# EAGLE schematic ArduRCT_Local-v3 (EAGLE 5.07)
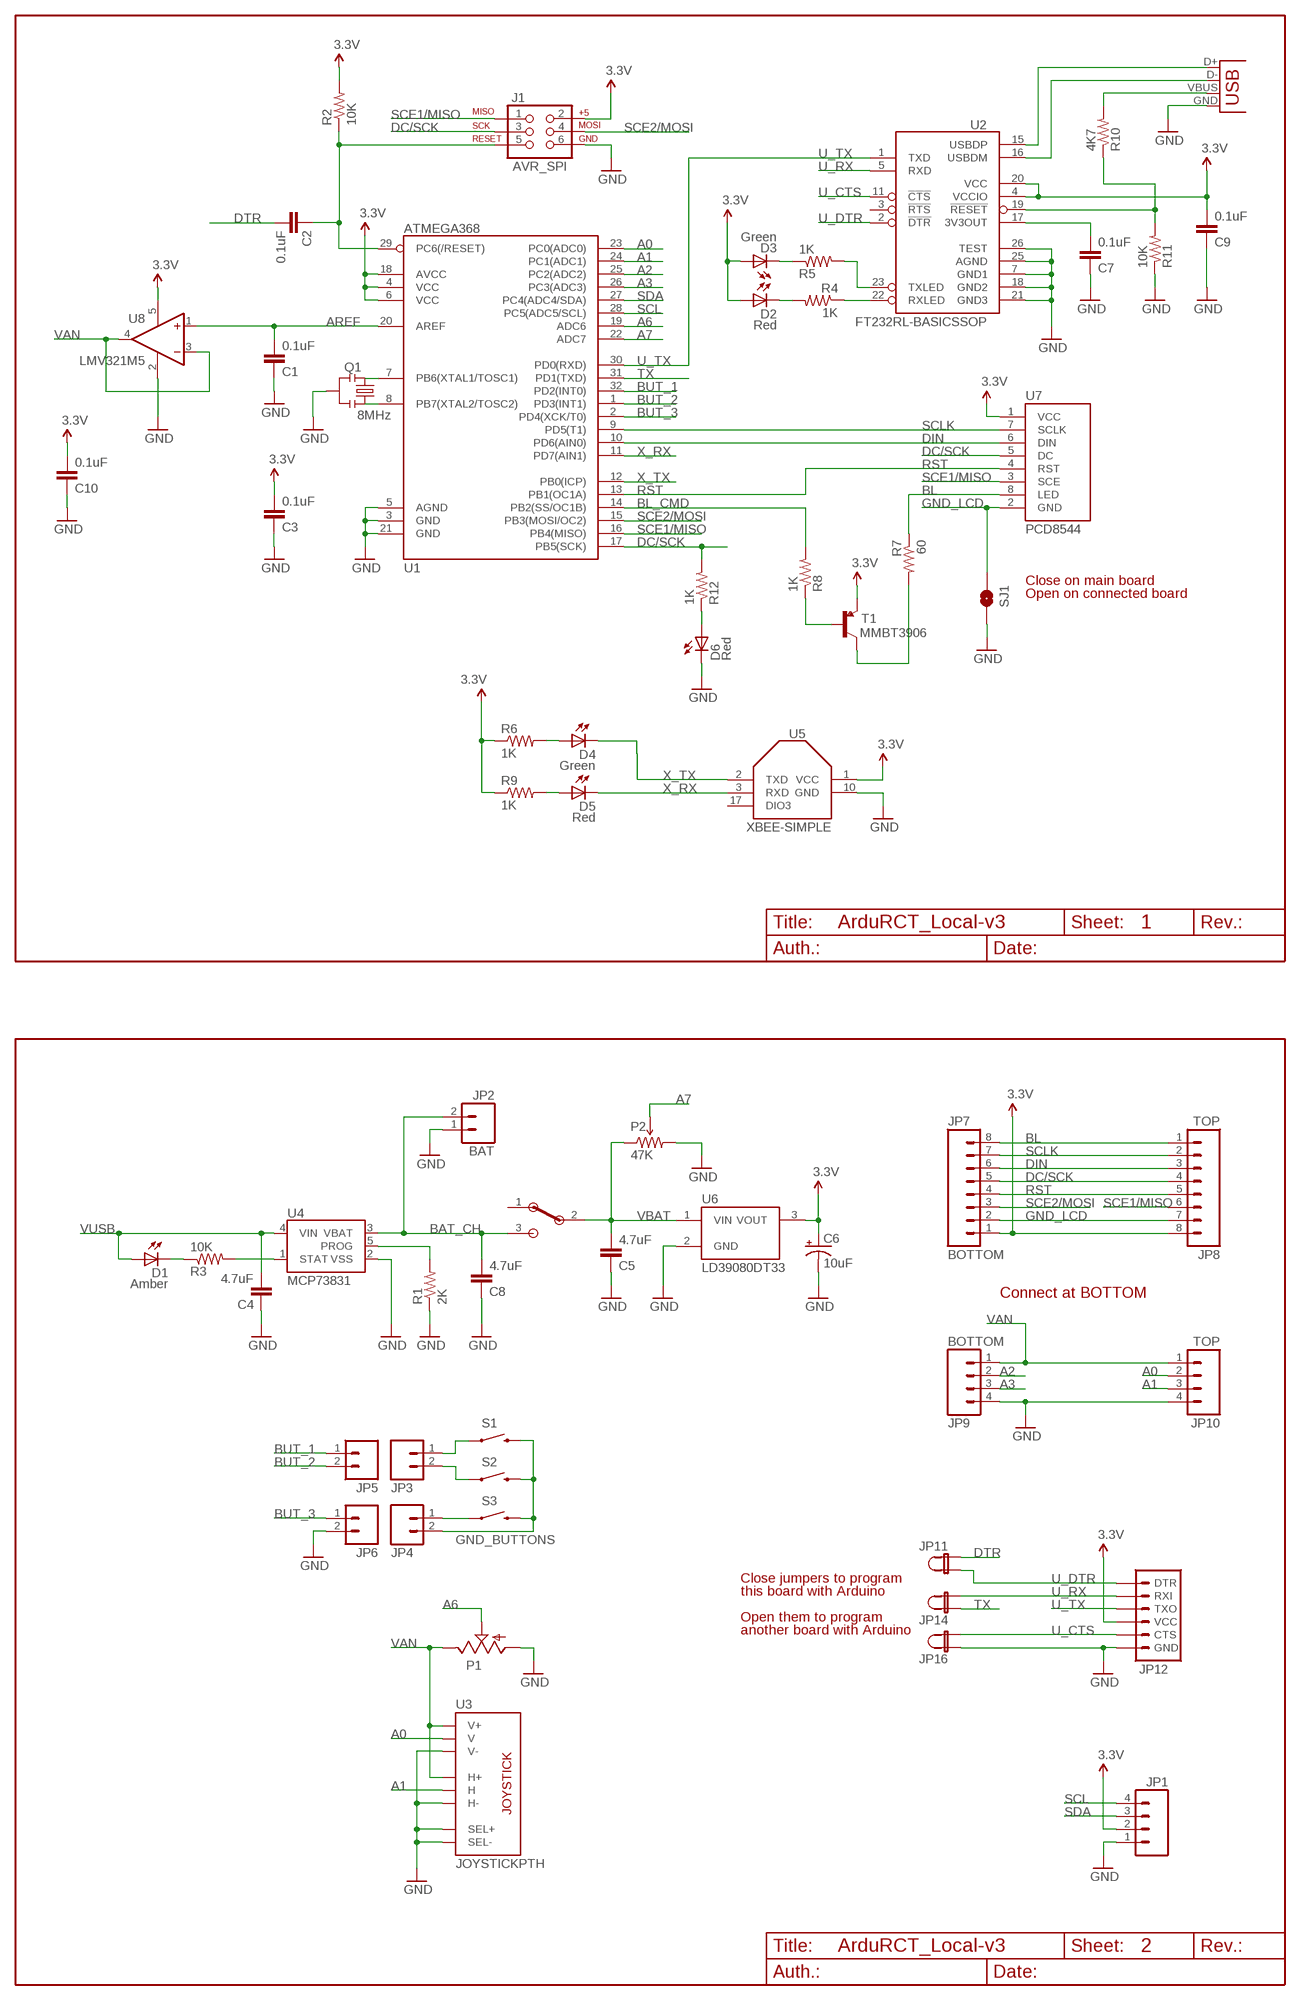
[diagram p0: schematic, sheet 1]

## Parts
C1  0.1uF  CAP0805  [0805]
C2  0.1uF  CAP0805  [0805]
C3  0.1uF  CAP0805  [0805]
C4  4.7uF  CAP0805  [0805]
C5  4.7uF  CAP0805  [0805]
C6  10uF  CAP_POL1206  [EIA3216]
C7  0.1uF  CAP0805  [0805]
C8  4.7uF  CAP0805  [0805]
C9  0.1uF  CAP0805  [0805]
C10  0.1uF  CAP0805  [0805]
D1  Amber  LED  [LED]
D2  Red  LED  [LED]
D3  Green  LED  [LED]
D4  Green  LED  [LED]
D5  Red  LED  [LED]
D6  Red  LED805  [LED-0805]
J1  AVR_SPI  AVR_SPI_PRG_6NS  [2X3-NS]
JP1  M04PTH  [1X04]
JP2  BAT  M02-JST-2MM-SMT  [JST-2-SMD]
JP3  M02PTH  [1X02]
JP4  M02PTH  [1X02]
JP5  M02PTH  [1X02]
JP6  M02PTH  [1X02]
JP7  BOTTOM  M08  [1X8_SMD]
JP8  TOP  M08  [1X8_SMD]
JP9  BOTTOM  M04SMD  [1X4_SMD]
JP10  TOP  M04SMD  [1X4_SMD]
JP11  JP_2_CLOSED  [1X2_CLOSED]
JP12  ARDUINO_SERIAL_PROGRAMPTH  [1X06]
JP14  JP_2_CLOSED  [1X2_CLOSED]
JP16  JP_2_CLOSED  [1X2_CLOSED]
P1  POT  [ALPS_POT]
P2  47K  TRIMPOT-2  [TRIMPOT_TC33]
Q1  8MHz  RESONATORSMD  [RESONATOR-SMD]
R1  2K  RESISTOR0805-RES  [0805]
R2  10K  RESISTOR0805-RES  [0805]
R3  10K  RESISTOR0805-RES  [0805]
R4  1K  RESISTOR0805-RES  [0805]
R5  1K  RESISTOR0805-RES  [0805]
R6  1K  RESISTOR0805-RES  [0805]
R7  60  RESISTOR0805-RES  [0805]
R8  1K  RESISTOR0805-RES  [0805]
R9  1K  RESISTOR0805-RES  [0805]
R10  4K7  RESISTOR0805-RES  [0805]
R11  10K  RESISTOR0805-RES  [0805]
R12  1K  RESISTOR0805-RES  [0805]
S1  SWITCH-MOMENTARY-2PTH  [TACTILE-PTH]
S2  SWITCH-MOMENTARY-2PTH  [TACTILE-PTH]
S3  SWITCH-MOMENTARY-2PTH  [TACTILE-PTH]
S4  EG1224  [EG1224]
SJ1  SOLDERJUMPERNC  [SJ_2S]
T1  MMBT3906  TRANSISTOR_PNPSMD  [SOT23-3]
U1  ATMEGA368  ATMEGA168  [TQFP32-08]
U2  FT232RL-BASICSSOP  [SSOP28DB]
U3  JOYSTICKPTH  [JOYSTICK]
U4  MCP73831  [SOT23-5]
U5  XBEE-SIMPLE  [XBEE-SMD]
U6  LD39080DT33  [DPAK]
U7  PCD8544  [PCD8544]
U8  LMV321M5  [SOT23-5]
X1  USBSMD  [USB-MINIB]

## Nets
3.3V: C3.2 C6.A(+) C9.2 C10.2 D2.A1(A) D3.A1(A) J1.2 JP1.2 JP7.1 JP8.8 JP12.4(VCC) R2.2 R6.1 R9.1 T1.2(E) U1.4(VCC) U1.6(VCC) U1.18(AVCC) U2.4(VCCIO) U2.20(VCC) U5.1(VCC) U6.3(VOUT) U7.1(VCC) U8.5(V+)
A0: JP10.2 U1.23(PC0(ADC0)) U3.V2(V)
A1: JP10.3 U1.24(PC1(ADC1)) U3.H2(H)
A2: JP9.2 U1.25(PC2(ADC2))
A3: JP9.3 U1.26(PC3(ADC3))
A6: P1.P$2(S) U1.19(ADC6)
A7: P2.2(WIPER) U1.22(ADC7)
AREF: C1.2 U1.20(AREF) U8.1(+IN)
BAT_CH: C8.2 JP2.2 S4.3 U4.3(VBAT)
BL: JP7.8 JP8.1 R7.1 U7.8(LED)
BL_CMD: R8.2 U1.14(PB2(SS/OC1B))
BUT_1: JP5.1 U1.32(PD2(INT0))
BUT_2: JP5.2 U1.1(PD3(INT1))
BUT_3: JP6.1 U1.2(PD4(XCK/T0))
DC/SCK: J1.3 JP7.5 JP8.4 R12.2 U1.17(PB5(SCK)) U7.5(DC)
DIN: JP7.6 JP8.3 U1.10(PD6(AIN0)) U7.6(DIN)
DTR: C2.2 JP11.1
GND [vcc]: C1.1 C3.1 C4.1 C5.1 C6.C(-) C7.1 C8.1 C9.1 C10.1 D6.2(C) J1.6 JP1.1 JP2.1 JP6.2 JP9.4 JP10.4 JP12.6(GND) JP16.1 P1.P$3(A) P2.3(CW) Q1.2 R1.1 R11.1 SJ1.2 U1.3(GND) U1.5(AGND) U1.21(GND) U2.7(GND1) U2.18(GND2) U2.21(GND3) U2.25(AGND) U2.26(TEST) U3.B1A(SEL+) U3.B2A(SEL-) U3.H3(H-) U3.V3(V-) U4.2(VSS) U5.10(GND) U6.2(GND) U8.2(V-) X1.GND
GND_BUTTONS: JP4.2 S1.3 S2.3 S3.3
GND_LCD [vcc]: JP7.2 JP8.7 SJ1.1 U7.2(GND)
N$1: Q1.1 U1.8(PB7(XTAL2/TOSC2))
N$2: Q1.3 U1.7(PB6(XTAL1/TOSC1))
N$3: JP3.1 S1.1
N$4: JP3.2 S2.1
N$5: JP4.1 S3.1
N$7: D6.1(A) R12.1
N$8: D1.C1(C) R3.1
N$9: U2.15(USBDP) X1.D+
N$10: U2.16(USBDM) X1.D-
N$11: R10.1 R11.2 U2.19(!RESET)
N$12: R3.2 U4.1(STAT)
N$13: R1.2 U4.5(PROG)
N$14: D5.A1(A) R9.2
N$17: R7.2 T1.3(C)
N$18: R5.2 U2.23(TXLED)
N$19: C7.2 U2.17(3V3OUT)
N$22: R4.1 U2.22(RXLED)
N$25: D4.A1(A) R6.2
N$27: R8.1 T1.1(B)
RESET: C2.1 J1.5 R2.1 U1.29(PC6(/RESET))
RST: JP7.4 JP8.5 U1.13(PB1(OC1A)) U7.4(RST)
SCE1/MISO: J1.1 JP8.6 U1.16(PB4(MISO)) U7.3(SCE)
SCE2/MOSI: J1.4 JP7.3 U1.15(PB3(MOSI/OC2))
SCL: JP1.4 U1.28(PC5(ADC5/SCL))
SCLK: JP7.7 JP8.2 U1.9(PD5(T1)) U7.7(SCLK)
SDA: JP1.3 U1.27(PC4(ADC4/SDA))
TX: JP14.1 U1.31(PD1(TXD))
U_CTS: JP12.5(CTS) JP16.2 U2.11(!CTS)
U_DTR: JP11.2 JP12.1(DTR) U2.2(!DTR)
U_RX: JP12.2(RXI) JP14.2 U2.5(RXD)
U_RX_LED: D2.C1(C) R4.2
U_TX: JP12.3(TXO) U1.30(PD0(RXD)) U2.1(TXD)
U_TX_LED: D3.C1(C) R5.1
VAN: JP9.1 JP10.1 P1.P$1(E) U3.H1(H+) U3.V1(V+) U8.3(-IN) U8.4(OUT)
VBAT: C5.2 P2.1(CCW) S4.2 U6.1(VIN)
VUSB: C4.2 D1.A1(A) R10.2 U4.4(VIN) X1.VBUS
X_RX: D5.C1(C) U1.11(PD7(AIN1)) U5.3(RXD)
X_TX: D4.C1(C) U1.12(PB0(ICP)) U5.2(TXD)
Unconnected: S4.1 U2.3(!RTS) U5.17(DIO3)

## Notes on the sheet
- Close on main board
- Open on connected board
- 1
- Connect at BOTTOM
- Close jumpers to program
- this board with Arduino
- Open them to program
- another board with Arduino
- 2

## Library data of the parts
C1-C5 C7-C10 = SparkFun:CAP: Capacitor Standard 0603 ceramic capacitor, and 0.1" leaded capacitor.
C6 = SparkFun:CAP_POL: Capacitor Polarized These are standard SMD and PTH capacitors. Normally 10uF, 47uF, and 100uF in electrolytic and tantalum varieties. Always verify the external diameter of the through hole cap, it varies with capacity, voltage, and manufacturer. The EIA devices should be standard.
D1-D6 = wibauxl:LED
J1 = SparkFun:AVR_SPI_PRG_6: AVR ISP 6 Pin This is the reduced ISP connector for AVR programming. Common on Arduino. This footprint will take up less PCB space and can be used with a 10-pin to 6-pin adapter such as SKU: BOB-08508
JP1 = SparkFun:M04: Header 4 Standard 4-pin 0.1" header. Use with straight break away headers (SKU : PRT-00116), right angle break away headers (PRT-00553), swiss pins (PRT-00743), machine pins (PRT-00117), and female headers (PRT-00115). Molex polarized connector foot print use with SKU : PRT-08231 with associated crimp pins and housings. 1MM SMD Version SKU: PRT-10208
JP2-JP6 = SparkFun:M02: Header 2 Standard 2-pin 0.1" header. Use with straight break away headers (SKU : PRT-00116), right angle break away headers (PRT-00553), swiss pins (PRT-00743), machine pins (PRT-00117), and female headers (PRT-00115). Molex polarized connector foot print use with SKU : PRT-08233 with associated crimp pins and housings.
JP7 JP8 = wibauxl:M08
JP9 JP10 = wibauxl:M04
JP11 JP14 JP16 = wibauxl:JP_2_CLOSED
JP12 = SparkFun:ARDUINO_SERIAL_PROGRAM
P1 = SparkFun:POT
P2 = SparkFun:TRIMPOT
Q1 = SparkFun:RESONATOR: Resonator Small SMD resonator. This is the itty bitty 10/20MHz resonators with built in caps. CSTCE10M0G55 and CSTCE20M0V53. Footprint has been reviewed closely but hasn't been tested yet.
R1-R12 = SparkFun:RESISTOR: Resistor Basic schematic elements and footprints for 0603, 1206, and PTH resistors.
S1-S3 = SparkFun:SWITCH-MOMENTARY-2
S4 = wibauxl:EG1224
SJ1 = SparkFun:SOLDERJUMPER: Solder Jumper Standard SMD solder jumper. Used to automate production. Two varients : Normally Open and Normally Closed are the same, but have different paste layers. NC will have a large amount of paste and should jumper during reflow.
T1 = wibauxl:TRANSISTOR_PNP: Such as the MMBT3906
U1 = SparkFun:ATMEGA168
U2 = wibauxl:FT232RL-BASIC: USB UART This is the simplified version of the FT232RL unit. Only what you need, nothing you don't. Spark Fun Electronics SKU : COM-00650
U3 = wibauxl:JOYSTICK: Thumb Joystick Joystick commonly found in PS2 controllers. Two pots and a select switch. Footprint proven. Spark Fun Electronics SKU : COM-09032
U4 = SparkFun:MCP73831: Microchip's MCP73831 Miniature single cell, fully integrated Li-Ion, Li-polymer charge management controller http://ww1.microchip.com/downloads/en/DeviceDoc/21984a.pdf
U5 = wibauxl:XBEE-SIMPLE
U6 = wibauxl:LD39080DT33
U7 = wibauxl:PCD8544
U8 = linear:LMV321?*: General Purpose, Low Voltage, Rail-to-Rail Output Operational Amplifiers Source: http://www.national.com/mpf/LM/LMV321.html http://www.national.com/dt/lmv_qual.pdf
X1 = SparkFun:USB: USB Connectors USB-B-PTH is fully proven SKU : PRT-00139 USB-miniB is fully proven SKU : PRT-00587 USB-A-PCB is untested. USB-A-H is throughly reviewed, but untested. Spark Fun Electronics SKU : PRT-00437 USB-B-SMT is throughly reviewed, but untested. Needs silkscreen touching up. USB-A-S has not been used/tested USB-MB-H has not been used/tested

## Net classes
0 default: width 0.203 mm
1 vcc: width 0.254 mm